# Altium schematic sheet Main.SchDoc
size A4; Organization: Altium Limited; Address1: 3 Minna Close; Address2: Belrose; Address3: NSW 2085; Address4: Australia; Revision: 1; SheetNumber: 1; SheetTotal: 2
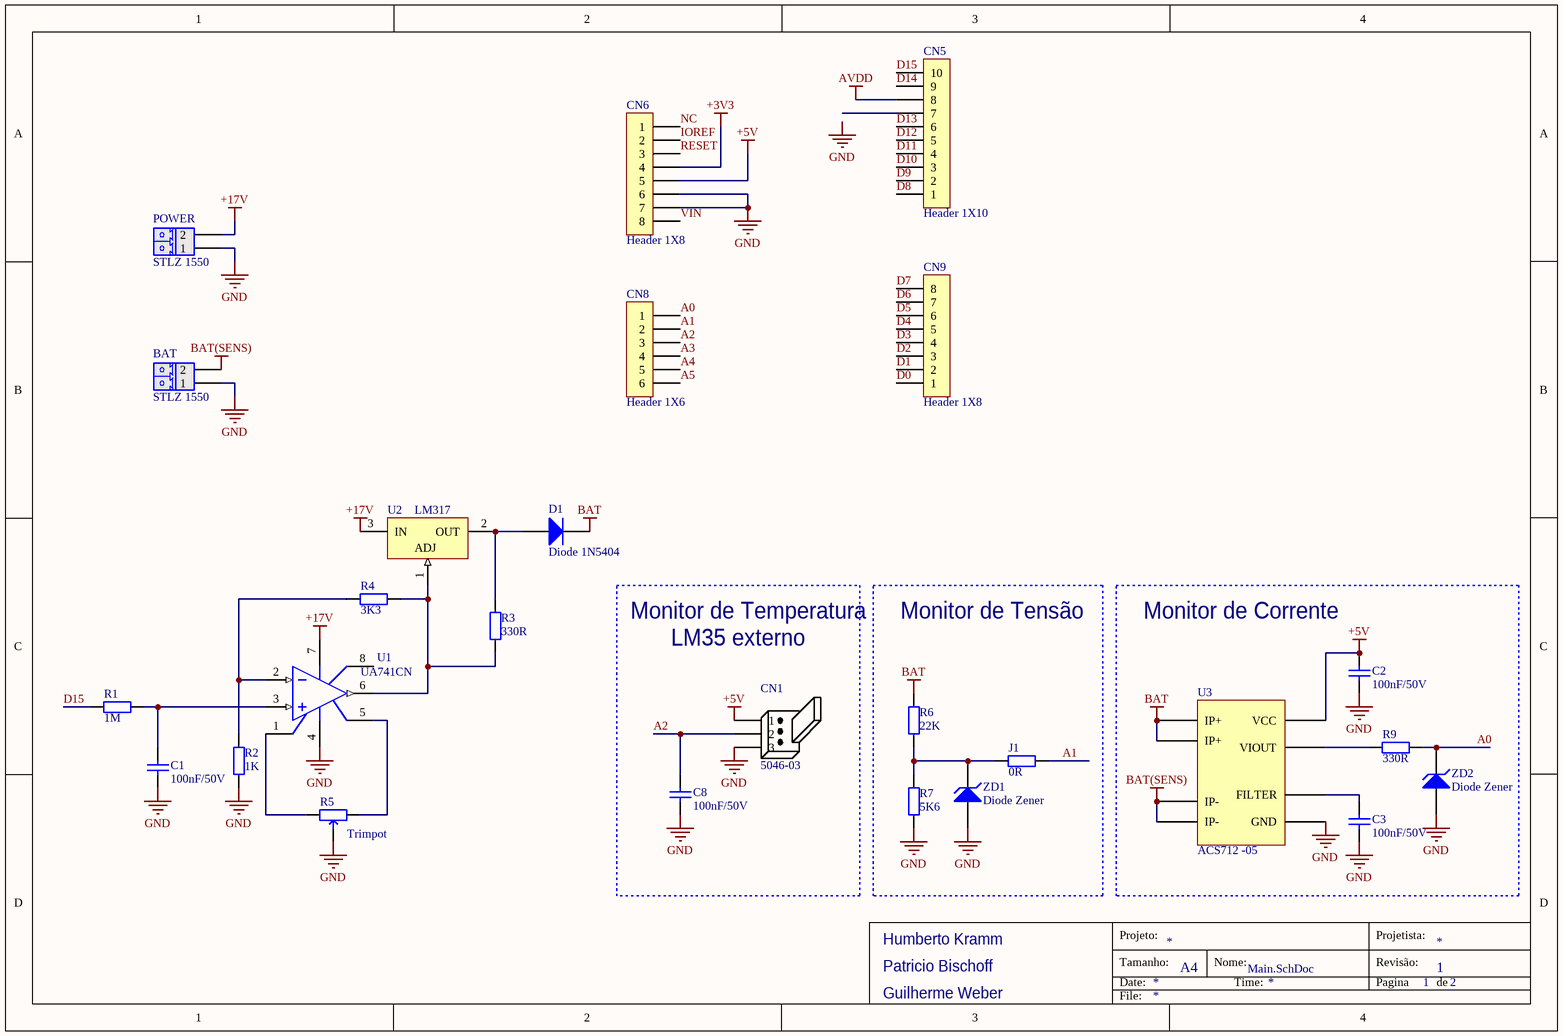
[diagram p0: Main.SchDoc]

## Parts
BAT  STLZ 1550  [STLZ 1550 H 02 PIN]
C1  value 100nF/50V  [CAP 0805]  (hidden comment: Cap.Cer. 100nF/50V SMD)
C2  value 100nF/50V  [CAP 0805]  (hidden comment: Cap.Cer. 100nF/50V SMD)  (no BOM)
C3  value 100nF/50V  [CAP 0805]  (hidden comment: Cap.Cer. 100nF/50V SMD)  (no BOM)
C8  value 100nF/50V  [CAP 0805]  (hidden comment: Cap.Cer. 100nF/50V SMD)
CN1  5046-03  [5046-03]
CN5  Header 1X10  [HEADER 1x10]
CN6  Header 1X8  [HEADER 1x8]
CN8  Header 1X6  [HEADER 1x6]
CN9  Header 1X8  [HEADER 1x8]
D1  Diode 1N5404  [DO-201AD]
J1  value 0R  [RES 0805]  (hidden comment: Res 0R SMD)
POWER  STLZ 1550  [STLZ 1550 H 02 PIN]
R1  value 1M  [RES 0805]  (hidden comment: Res 2M SMD)
R2  value 1K  [RES 0805]  (hidden comment: Res 1K SMD)
R3  value 330R  [RES 0805]  (hidden comment: Res 330R SMD)
R4  value 3K3  [RES 0805]  (hidden comment: Res 3K3 SMD)
R5  Trimpot  [3006P]
R6  value 22K  [RES 0805]  (hidden comment: Res 22K SMD)
R7  value 5K6  [RES 0805]  (hidden comment: Res 5K6 SMD)
R9  value 330R  [RES 0805]  (hidden comment: Res 330R SMD)
U1  UA741CN  [PDIP300-P8]
U2  LM317  [TO-220A 90°]
U3  ACS712 -05  [SOIC-08]  (no BOM)
ZD1  Diode Zener  [MINI MELF]
ZD2  Diode Zener  [MINI MELF]

## Blocks framed on the sheet
Monitor de Tensão: J1 R6 R7 ZD1
Monitor de Corrente: C2 C3 R9 U3 ZD2

## Nets
+3V3: CN6.4
+5V: C2.1 CN1.1 CN6.5 U3.8(VCC)
+17V: POWER.2 U1.7(V+) U2.3(IN)
AVDD: CN5.8
BAT: D1.2(K) R6.2 U3.1(IP+) U3.2(IP+)
BAT(SENS): BAT.2 U3.3(IP-) U3.4(IP-)
GND: BAT.1 C1.1 C2.2 C3.2 C8.1 CN1.3 CN6.6 CN6.7 POWER.1 R2.1 R5.2 R7.1 U1.4(V-) U3.5(GND) ZD1.1(A) ZD2.1(A)
A0: CN8.1 R9.2 ZD2.2(K)
A1: CN8.2 J1.2
A2: C8.2 CN1.2 CN8.3
A3: CN8.4
A4: CN8.5
A5: CN8.6
D0: CN9.1
D1: CN9.2
D2: CN9.3
D3: CN9.4
D4: CN9.5
D5: CN9.6
D6: CN9.7
D7: CN9.8
D8: CN5.1
D9: CN5.2
D10: CN5.3
D11: CN5.4
D12: CN5.5
D13: CN5.6
D14: CN5.9
D15: CN5.10 R1.1
IOREF: CN6.2
NC: CN6.1
RESET: CN6.3
VIN: CN6.8
NetC1_2: C1.2 R1.2 U1.3(IN+)
NetC3_1: C3.1 U3.6(FILTER)
NetD1_1: D1.1(A) R3.2 U2.2(OUT)
NetJ1_1: J1.1 R6.1 R7.2 ZD1.2(K)
NetR2_2: R2.2 R4.1 U1.2(IN-)
NetR3_1: R3.1 R4.2 U1.6(OUT) U2.1(ADJ)
NetR5_1: R5.1 U1.5(OS_NULL)
NetR5_3: R5.3 U1.1(OS_NULL)
NetR9_1: R9.1 U3.7(VIOUT)

Not connected (* = marked no-connect by the designer): CN5 7; U1 8(NC)

## Notes on the sheet
- Monitor de Temperatura
- LM35 externo
- Humberto Kramm
- Patricio Bischoff
- Guilherme Weber
- Labels drawn without touching a wire or pin: GND
- Projeto:
- Tamanho:
- Date:
- A4
- Nome:
- Time:
- Pagina
- Projetista:
- Revisão:
- de
- File:

## Library data of the parts
BAT POWER = CONECTOR STLZ 1550/02G H: CONECTOR STLZ 1550 2pin Horizontal; Código: 7060; Almox.Gaia: CONECTOR STLZ 1550/02G H
C1-C3 C8 = Cap.Cer. 100nF/50V SMD: Capacitor Cerâmico; Almox.Gaia: SMD CAPACITOR CERAMICO 100nF/50V 0805; Código: 7021; Published: 8-Jun-2000; LatestRevisionDate: 22-Mar-2011; LatestRevisionNote: Re-released for DXP Platform.; PackageReference: RAD-0.3; Publisher: Altium Limited
  C1 C8: Supplier 1: Digi-Key; Supplier 2: Newark; Supplier 3: Mouser; Supplier Part Number 1: 1276-1007-2-ND; Supplier Part Number 2: 58Y7818; Supplier Part Number 3: 581-08055C104J
CN1 = CONECTOR 5046-03: CONECTOR MOLEX KK 5045 90° 2,54mm  3 VIAS; Código: 000587; LatestRevisionDate: 22-Mar-2011; LatestRevisionNote: Re-released for DXP Platform.; Publisher: Altium Limited; Almox.Gaia: CONECTOR 5046-03
CN5 = Header 1X10: Header, 10-Pin, single row, right angle; Almox.Gaia: BARRA DE PINOS 1X40; Código: 7095; LatestRevisionDate: 17-Jul-2002; LatestRevisionNote: Re-released for DXP Platform.; Publisher: Altium Limited
CN6 CN9 = Header 1X8: Header, 8-Pin, single row; Almox.Gaia: BARRA DE PINOS 1X40; Código: 7094; LatestRevisionDate: 17-Jul-2002; LatestRevisionNote: Re-released for DXP Platform.; Publisher: Altium Limited
CN8 = Header 1X6: Header, 6-Pin, single row; Almox.Gaia: BARRA DE PINOS 1X40; Código: 7094; LatestRevisionDate: 17-Jul-2002; LatestRevisionNote: Re-released for DXP Platform.; Publisher: Altium Limited
D1 = Diode 1N5404: 3 Amp General Purpose Rectifier; Almox.Gaia: DIODO 1N5404; Código: 000604; Published: 8-Jun-2000; LatestRevisionDate: 22-Mar-2011; LatestRevisionNote: Re-released for DXP Platform.; DatasheetVersion: 1998; PackageVersion: Aug-1999; PackageReference: DO-201AD; Publisher: Altium Limited; ComponentLink1Description: Manufacturer Link; ComponentLink1URL: http://www.fairchildsemi.com/; ComponentLink2Description: Datasheet; ComponentLink2URL: http://www.fairchildsemi.com/ds/1N%2F1N5400.pdf
J1 = Res 0R SMD: Resistor; Almox.Gaia: SMD RESISTOR   0R 0805; Código: 004904; Published: 8-Jun-2000; LatestRevisionDate: 22-Mar-2011; LatestRevisionNote: Re-released for DXP Platform.; PackageReference: AXIAL-0.4; Publisher: Altium Limited; Supplier 1: Digi-Key; Supplier 2: Newark; Supplier 3: Mouser; Supplier Part Number 1: 311-0.0ARCT-ND; Supplier Part Number 2: 68R0285; Supplier Part Number 3: 667-ERJ-6GEY0R00V
R1 = Res 2M SMD: Resistor; Almox.Gaia: SMD RESISTOR    2M 0805; Código: 005147; Published: 8-Jun-2000; LatestRevisionDate: 22-Mar-2011; LatestRevisionNote: Re-released for DXP Platform.; PackageReference: AXIAL-0.4; Publisher: Altium Limited; Supplier 1: Digi-Key; Supplier 2: Newark; Supplier 3: Mouser; Supplier Part Number 1: P2.0MACT-ND; Supplier Part Number 2: 59M6868; Supplier Part Number 3: 667-ERJ-U06J205V
R2 = Res 1K SMD: Resistor; Almox.Gaia: SMD RESISTOR    1K 0805; Código: 004903; Published: 8-Jun-2000; LatestRevisionDate: 22-Mar-2011; LatestRevisionNote: Re-released for DXP Platform.; PackageReference: AXIAL-0.4; Publisher: Altium Limited; Supplier 1: Digi-Key; Supplier 2: Newark; Supplier 3: Mouser; Supplier Part Number 1: P1.00KCCT-ND; Supplier Part Number 2: 65J1337; Supplier Part Number 3: 667-ERJ-6GEYJ102V
R3 R9 = Res 330R SMD: Resistor; Almox.Gaia: SMD RESISTOR 330R 0805; Código: 004908; Published: 8-Jun-2000; LatestRevisionDate: 22-Mar-2011; LatestRevisionNote: Re-released for DXP Platform.; PackageReference: SDM; Publisher: Altium Limited; Supplier 1: Digi-Key; Supplier 2: Newark; Supplier 3: Mouser; Supplier Part Number 1: RMCF0805JT330RTR-ND; Supplier Part Number 2: 58K4809; Supplier Part Number 3: 71-CRCW0805-330-E3
R4 = Res 3K3 SMD: Resistor; Almox.Gaia: SMD RESISTOR    3K3 0805; Código: 005136; Published: 8-Jun-2000; LatestRevisionDate: 22-Mar-2011; LatestRevisionNote: Re-released for DXP Platform.; PackageReference: AXIAL-0.4; Publisher: Altium Limited; Supplier 1: Digi-Key; Supplier 2: Newark; Supplier 3: Mouser; Supplier Part Number 1: RMCF0805JT3K30TR-ND; Supplier Part Number 2: 68R0241; Supplier Part Number 3: 71-CRCW0805-3.3K-E3
R5 = Trimpot: Variable Resistor; Sim Note: Enter the Resistance value and the set point into parameter fields.; Set Position: 0.5; Almox.Gaia: TRIMPOT 10K VERTIVAL; Código: 7273; Published: 24-Mar-1999; LatestRevisionDate: 17-Jul-2002; LatestRevisionNote: Re-released for DXP Platform.; PackageReference: VR3; Publisher: Altium Limited
R6 = Res 22K SMD: Resistor; Almox.Gaia: SMD RESISTOR   22K 0805; Código: 004907; Published: 8-Jun-2000; LatestRevisionDate: 22-Mar-2011; LatestRevisionNote: Re-released for DXP Platform.; PackageReference: AXIAL-0.4; Publisher: Altium Limited; Supplier 1: Digi-Key; Supplier 2: Newark; Supplier 3: Mouser; Supplier Part Number 1: RMCF0805JT22K0TR-ND; Supplier Part Number 2: 59M6874; Supplier Part Number 3: 667-ERJ-6GEYJ223V
R7 = Res 5K6 SMD: Resistor; Almox.Gaia: SMD RESISTOR    5K6 0805; Código: 005142; Published: 8-Jun-2000; LatestRevisionDate: 22-Mar-2011; LatestRevisionNote: Re-released for DXP Platform.; PackageReference: AXIAL-0.4; Publisher: Altium Limited; Supplier 1: Digi-Key; Supplier 2: Newark; Supplier 3: Mouser; Supplier Part Number 1: 541-5.60KCCT-ND; Supplier Part Number 2: 33C6610; Supplier Part Number 3: 667-ERJ-6GEYJ562V
U1 = UA741CN: General-Purpose Single Operational Amplifier; Published: 24-Aug-2001; LatestRevisionDate: 06-Jun-2005; LatestRevisionNote: Stylized 3D Model Added.; DatasheetVersion: Oct-1997; PackageReference: DIP8; Publisher: Altium Limited; PackageDescription: DIP; 8 Leads; Row Spacing 7.62 mm; Pitch 2.54 mm; Code_JEDEC: MO-001-AN; ComponentLink1Description: Manufacturer Link; ComponentLink1URL: http://www.st.com/; ComponentLink2Description: Datasheet; ComponentLink2URL: http://www.st.com/stonline/products/literature/ds/5304/ua741.pdf
U2 = LM317: Positive Voltage Regulator; Note: Tab is connected to pin 3 (GND).; Almox.Gaia: CI 7812; Código: 000579; Published: 24-Aug-2001; LatestRevisionDate: 17-Jul-2002; LatestRevisionNote: Re-released for DXP Platform.; DatasheetVersion: Dec-1998; PackageVersion: Jun-1998; PackageReference: TO220ABN; Publisher: Altium Limited; PackageDescription: TO, Thru-Hole, Vertical, Heatsink Mounted; 3 In-Line Leads; Pitch 2.54 mm; Pin sequence 1, 3, 2; ComponentLink1Description: Manufacturer Link; ComponentLink1URL: http://www.st.com/
U3 = ACS712 -05: Sensor de Efeito Hall; Almox.Gaia: CI ACS712 -05; Código: 7003; Published: 6-Oct-2005; LatestRevisionDate: 13-Apr-2006; LatestRevisionNote: IPC-7351 Footprint Added.; DatasheetVersion: ver 1.7, Feb-2005; PackageVersion: Mar-2004; PackageReference: 8-pin SOIC; Publisher: Altium Limited
ZD1 ZD2 = Diode Zener SMD 4,7V: Zener Diode; Almox.Gaia: SMD DIODO ZENER 4,7V; Código: 7388; Published: 8-Jun-2000; LatestRevisionDate: 17-Jul-2002; LatestRevisionNote: Re-released for DXP Platform.; PackageReference: DIODE-0.7; Publisher: Altium Limited; Supplier 1: Digi-Key; Supplier 2: Newark; Supplier 3: Mouser; Supplier Part Number 1: 568-8216-2-ND; Supplier Part Number 2: 70R4020; Supplier Part Number 3: 833-DL5230B-TP